# EAGLE design atmega32u4bb (EAGLE 6.0)
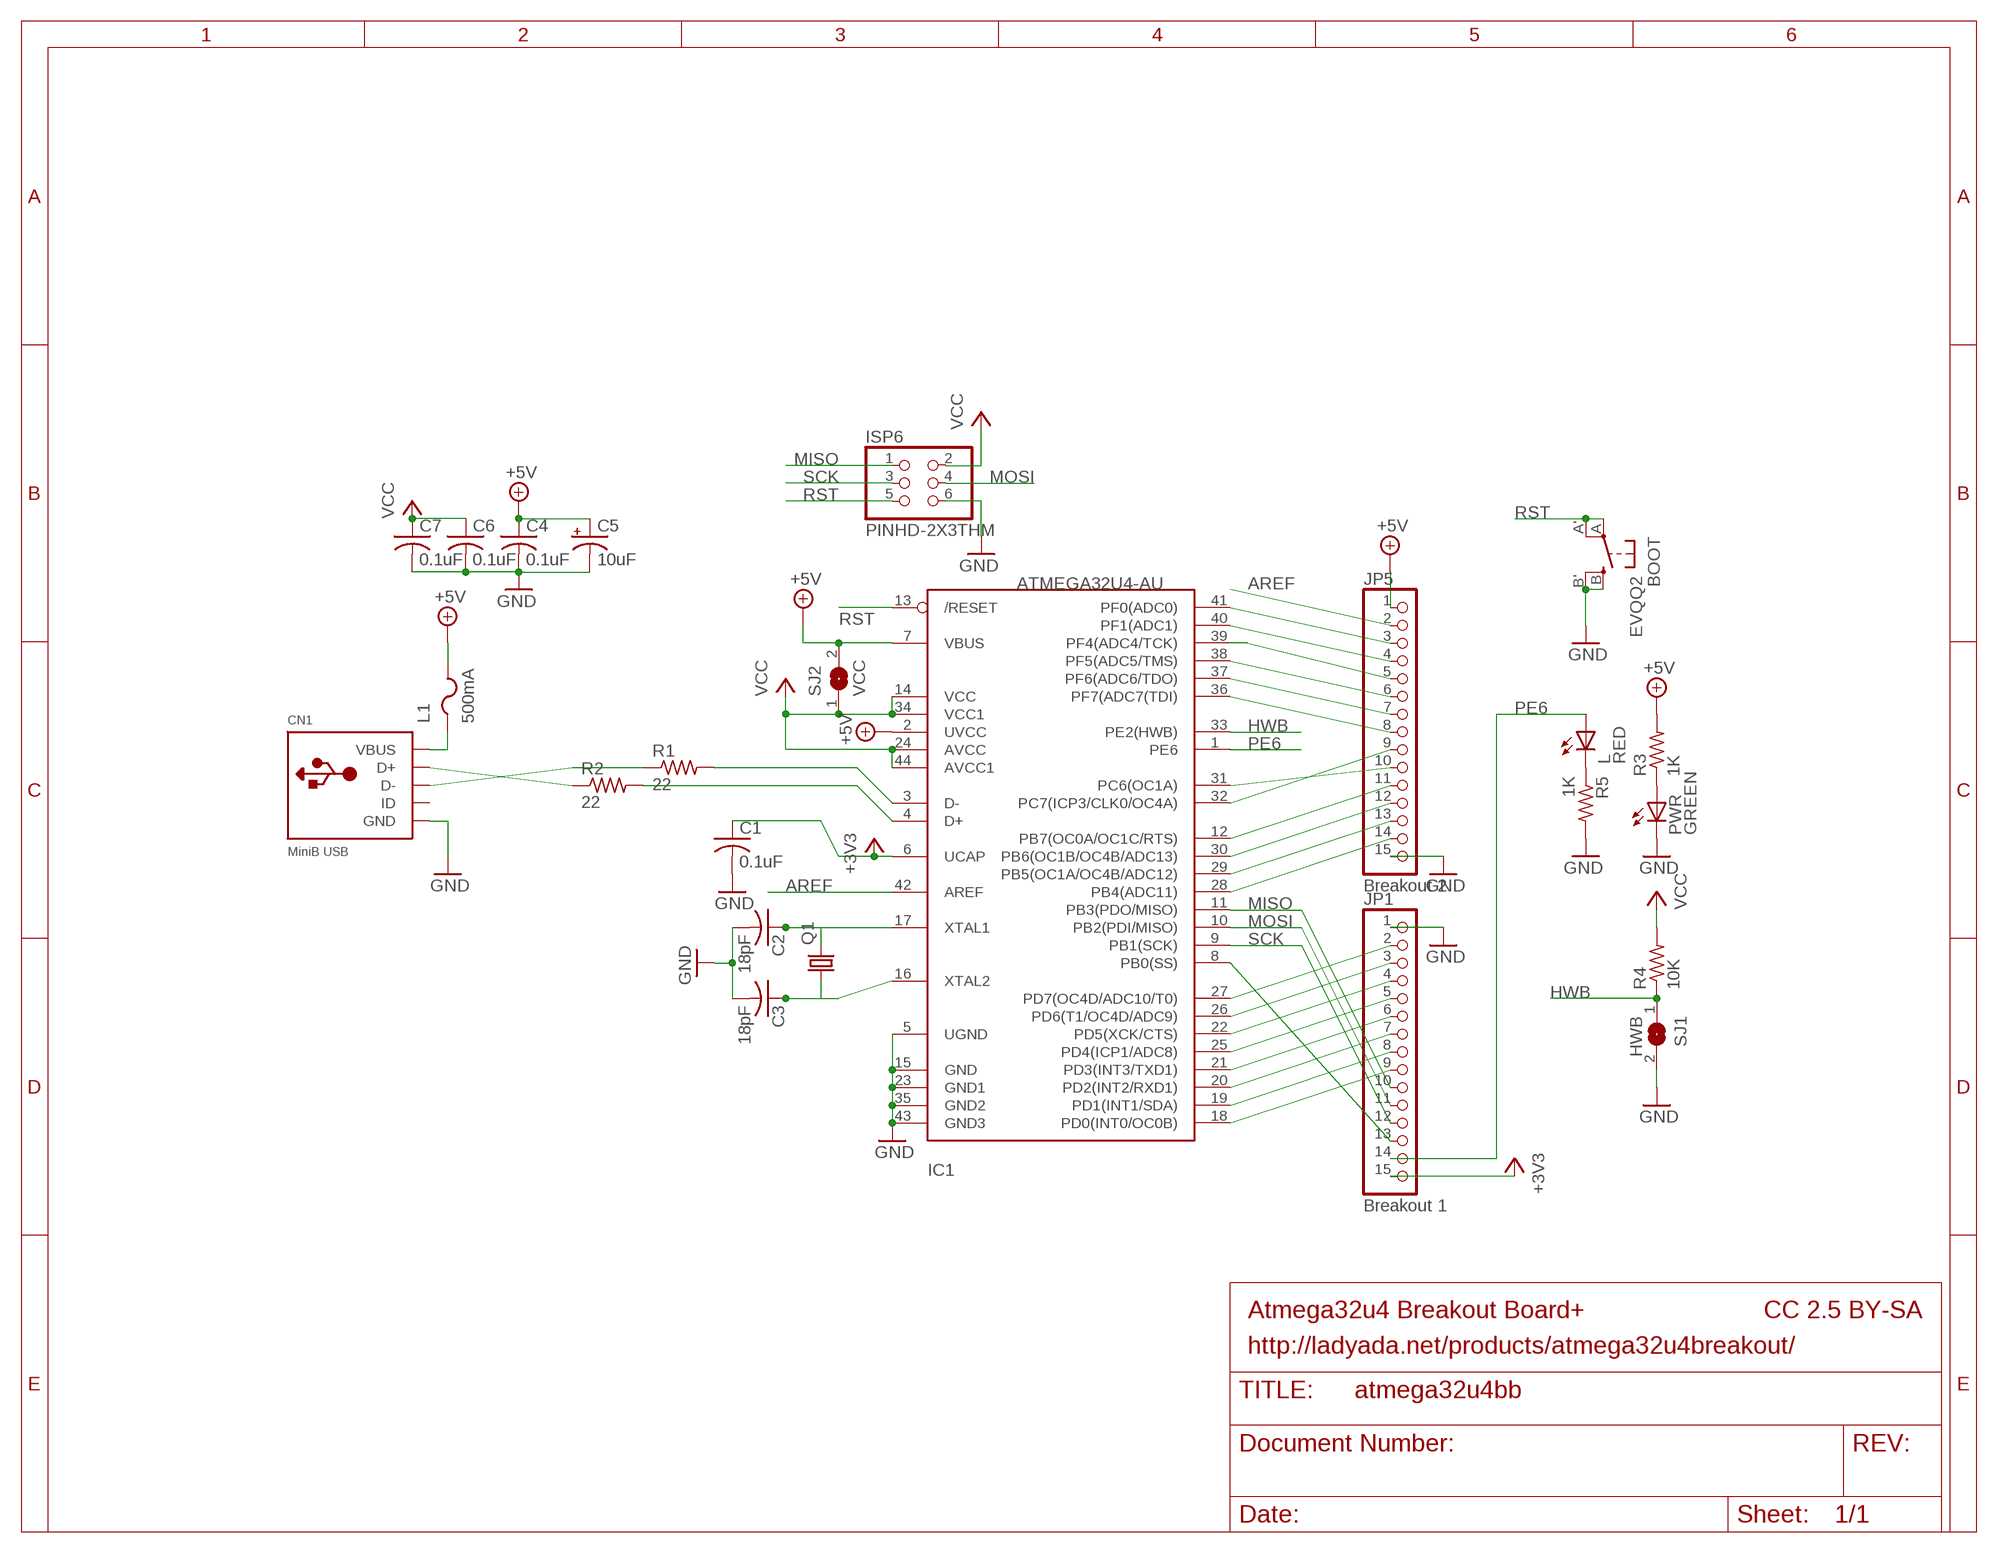
[diagram p0: schematic, sheet 1]

## Parts
BOOT  EVQQ2  [EVQ-Q2]
C1  0.1uF  C-USC0805K  [C0805K]
C2  18pF  C-USC0805K  [C0805K]
C3  18pF  C-USC0805K  [C0805K]
C4  0.1uF  C-USC0805K  [C0805K]
C5  10uF  CPOL-USA/3216-18R  [A/3216-18R]
C6  0.1uF  C-USC0805K  [C0805K]
C7  0.1uF  C-USC0805K  [C0805K]
CN1  MiniB USB  USBMINIB  [USB-MINIB]
IC1  ATMEGA32U4-AU  [TQFP44]
ISP6  PINHD-2X3THM  [ISP6]
JP1  Breakout 1  PINHD-1X15-CB  [1X15-CB]
JP5  Breakout 2  PINHD-1X15-CB  [1X15-CB]
L  RED  LEDCHIPLED_0805  [CHIPLED_0805]
L1  500mA  PTCFUSE-1206  [R1206]
PWR  GREEN  LEDCHIPLED_0805  [CHIPLED_0805]
Q1  CRYSTALHC49UP  [HC49UP]
R1  22  R-US_R0805  [R0805]
R2  22  R-US_R0805  [R0805]
R3  1K  R-US_R0805  [R0805]
R4  10K  R-US_R0805  [R0805]
R5  1K  R-US_R0805  [R0805]
SJ1  HWB  SJ  [SJ]
SJ2  VCC  SJ  [SJ]

## Nets
+3V3: C1.1 IC1.6(UCAP) JP1.15
+5V: C4.1 C5.+ IC1.2(UVCC) IC1.7(VBUS) JP5.1 L1.2 R3.2 SJ2.2
AREF: IC1.42(AREF) JP5.2
GND: BOOT.B'(S1) BOOT.B(S) C1.2 C2.2 C3.2 C4.2 C5.- C6.2 C7.2 CN1.GND IC1.5(UGND) IC1.15(GND) IC1.23(GND1) IC1.35(GND2) IC1.43(GND3) ISP6.6 JP1.1 JP5.15 PWR.C R5.2 SJ1.2
HWB: IC1.33(PE2(HWB)) R4.1 SJ1.1
MISO: IC1.11(PB3(PDO/MISO)) ISP6.1 JP1.10
MOSI: IC1.10(PB2(PDI/MISO)) ISP6.4 JP1.11
N$1: PWR.A R3.1
N$2: CN1.D+ R2.1
N$3: IC1.3(D-) R1.2
N$4: IC1.4(D+) R2.2
N$5: CN1.D- R1.1
N$8: C2.1 IC1.17(XTAL1) Q1.2
N$9: C3.1 IC1.16(XTAL2) Q1.1
N$10: L.C R5.1
PB0: IC1.8(PB0(SS)) JP1.13
PB4: IC1.28(PB4(ADC11)) JP5.14
PB5: IC1.29(PB5(OC1A/OC4B/ADC12)) JP5.13
PB6: IC1.30(PB6(OC1B/OC4B/ADC13)) JP5.12
PB7: IC1.12(PB7(OC0A/OC1C/RTS)) JP5.11
PC6: IC1.31(PC6(OC1A)) JP5.10
PC7: IC1.32(PC7(ICP3/CLK0/OC4A)) JP5.9
PD0: IC1.18(PD0(INT0/OC0B)) JP1.9
PD1: IC1.19(PD1(INT1/SDA)) JP1.8
PD2: IC1.20(PD2(INT2/RXD1)) JP1.7
PD3: IC1.21(PD3(INT3/TXD1)) JP1.6
PD4: IC1.25(PD4(ICP1/ADC8)) JP1.5
PD5: IC1.22(PD5(XCK/CTS)) JP1.4
PD6: IC1.26(PD6(T1/OC4D/ADC9)) JP1.3
PD7: IC1.27(PD7(OC4D/ADC10/T0)) JP1.2
PE6: IC1.1(PE6) JP1.14 L.A
PF0: IC1.41(PF0(ADC0)) JP5.3
PF1: IC1.40(PF1(ADC1)) JP5.4
PF4: IC1.39(PF4(ADC4/TCK)) JP5.5
PF5: IC1.38(PF5(ADC5/TMS)) JP5.6
PF6: IC1.37(PF6(ADC6/TDO)) JP5.7
PF7: IC1.36(PF7(ADC7(TDI)) JP5.8
RST: BOOT.A'(P1) BOOT.A(P) IC1.13(/RESET) ISP6.5
SCK: IC1.9(PB1(SCK)) ISP6.3 JP1.12
VBUS: CN1.VBUS L1.1
VCC: C6.1 C7.1 IC1.14(VCC) IC1.24(AVCC) IC1.34(VCC1) IC1.44(AVCC1) ISP6.2 R4.2 SJ2.1
Unconnected: CN1.ID

## Notes on the sheet
- Atmega32u4 Breakout Board+ | CC 2.5 BY-SA
- http://ladyada.net/products/atmega32u4breakout/

## Library data of the parts
BOOT = adaprog:EVQQ2
C1-C4 C6 C7 = adafruit:C-US: CAPACITOR, American symbol
C5 = adafruit:CPOL-US: POLARIZED CAPACITOR, American symbol
CN1 = adafruit:USB: USB Connectors USBMINIB - Surface Mount Female Mini-B USB Connector 4UConnector: 06564 By microbuilder.eu Thru-hole RA Female Mini-B USB Connector 4UConnector: 18732 By ladyada.net
IC1 = adaprog:ATMEGA32U4
ISP6 = adaprog:PINHD-2X3
JP1 JP5 = adafruit:PINHD-1X15: PIN HEADER
L PWR = adafruit:LED: LED OSRAM: - CHIPLED LG R971, LG N971, LY N971, LG Q971, LY Q971, LO R971, LY R971 LH N974, LH R974 LS Q976, LO Q976, LY Q976 LO Q996 - Hyper CHIPLED LW Q18S LB Q993, LB Q99A, LB R99A - SideLED LS A670, LO A670, LY A670, LG A670, LP A670 LB A673, LV A673, LT A673, LW A673 LH A674 LY A675 LS A676, LA A676, LO A676, LY A676, LW A676 LS A679, LY A679, LG A679 - Hyper Micro SIDELED® LS Y876, LA Y876, LO Y876, LY Y876 LT Y87S - SmartLED LW L88C, LW L88S LB L89C, LB L89S, LG L890 LS L89K, LO L89K, LY L89K LS L896, LA L896, LO L896, LY L896 - TOPLED LS T670, LO T670, LY T670, LG T670, LP T670 LSG T670, LSP T670, LSY T670, LOP T670, LYG T670 LG T671, LOG T671, LSG T671 LB T673, LV T673, LT T673, LW T673 LH T674 LS T676, LA T676, LO T676, LY T676, LB T676, LH T676, LSB T676, LW T676 LB T67C, LV T67C, LT T67C, LS T67K, LO T67K, LY T67K, LW E67C LS E67B, LA E67B, LO E67B, LY E67B, LB E67C, LV E67C, LT E67C LW T67C LS T679, LY T679, LG T679 LS T770, LO T770, LY T770, LG T770, LP T770 LB T773, LV T773, LT T773, LW T773 LH T774 LS E675, LA E675, LY E675, LS T675 LS T776, LA T776, LO T776, LY T776, LB T776 LHGB T686 LT T68C, LB T68C - Hyper Mini TOPLED® LB M676 - Mini TOPLED Santana® LG M470 LS M47K, LO M47K, LY M47K Source: http://www.osram.convergy.de/
L1 = adafruit:PTCFUSE: PTC fuses, resettable thermistors
Q1 = crystal:CRYSTAL: CRYSTAL; OC_FARNELL: unknown; OC_NEWARK: unknown
R1-R5 = adafruit:R-US_: RESISTOR, American symbol
SJ1 SJ2 = jumper:SJ: SMD solder JUMPER

## Board
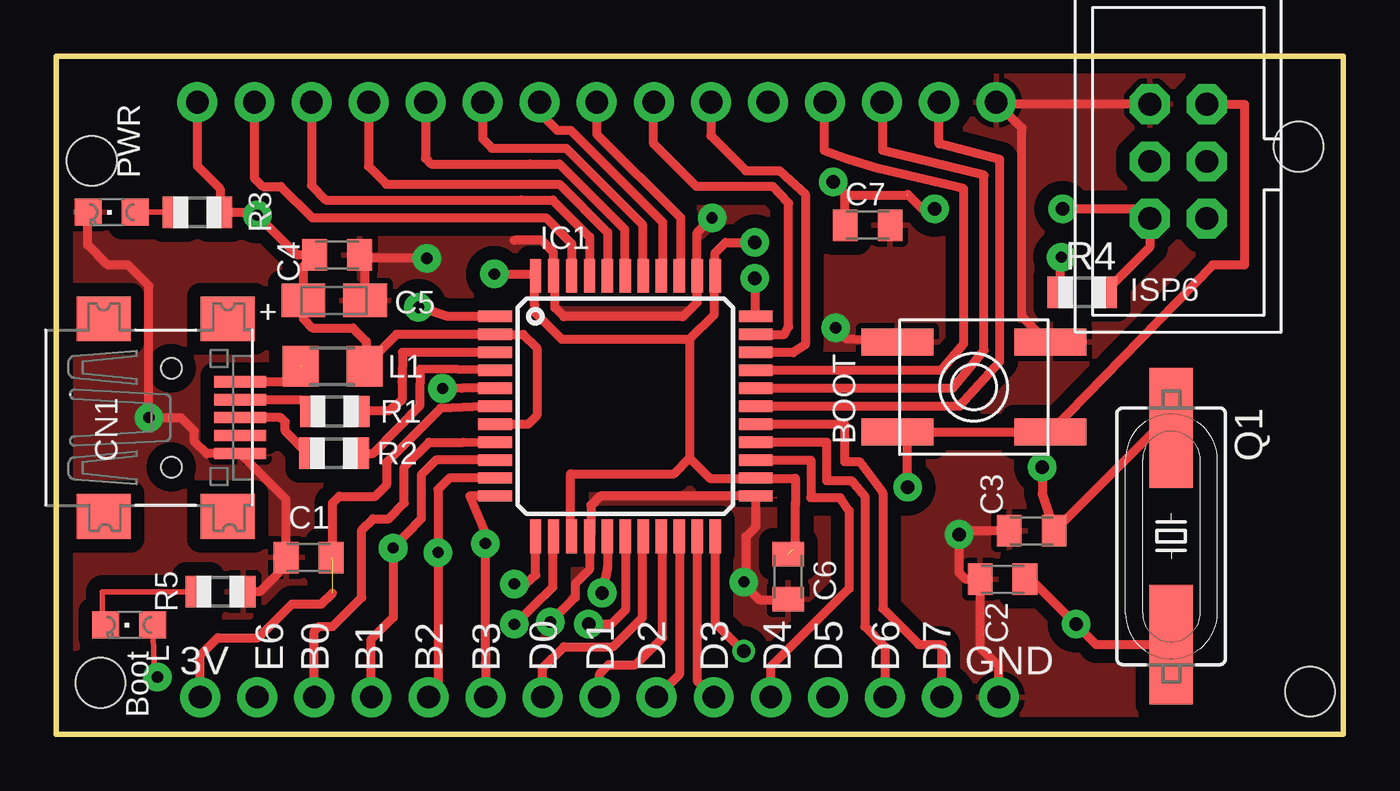
[diagram p1: board, top side]
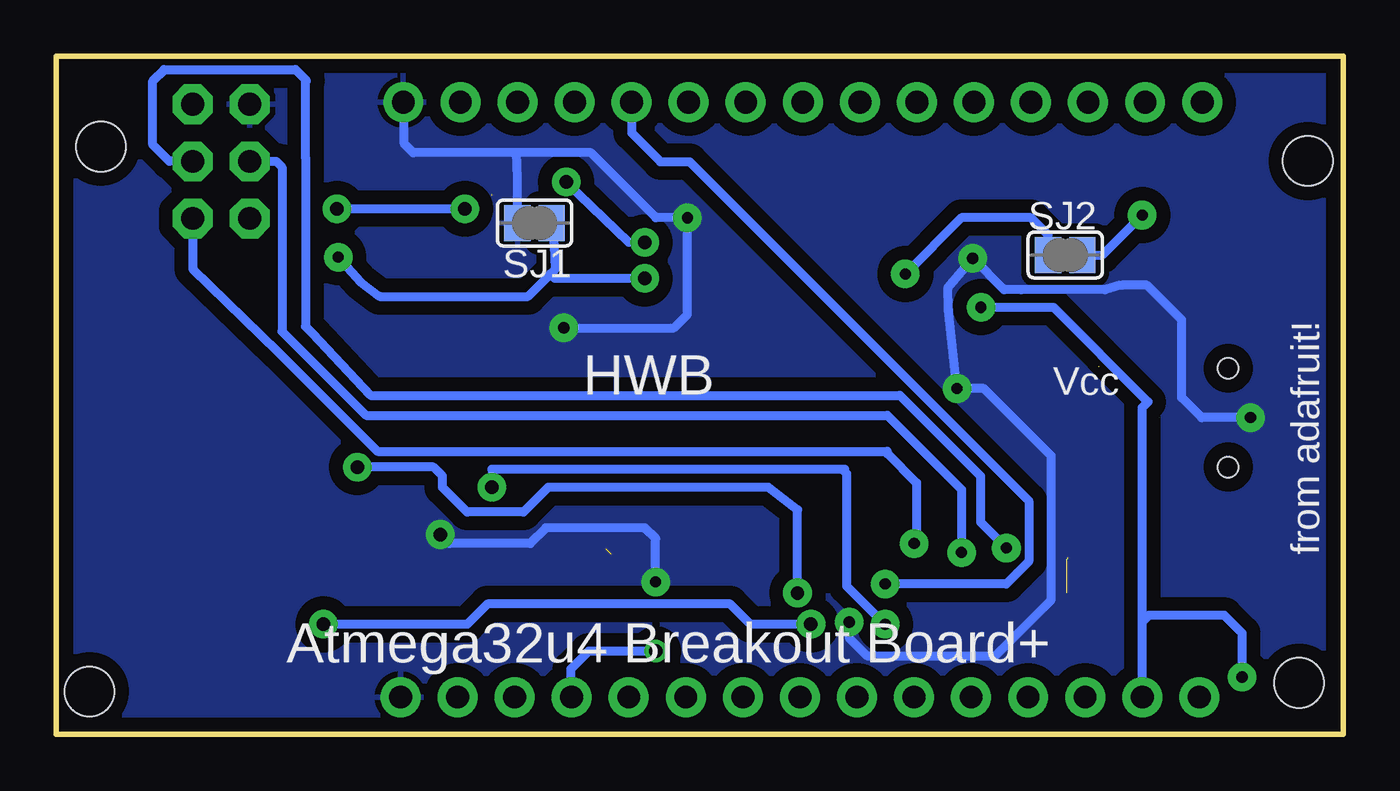
[diagram p2: board, bottom side, seen from below]

Size 57.3 x 30.2 mm. Coordinates in mm from the lower left corner, seen from the top.
Outline: 0.4,30.2 0.5,30.2
Outline: 0.5,30.2 57.3,30.2 57.3,0 0,0 0,30.2 0.5,30.2
Copper layers (1*16): Top 0.035mm / dielectric 1.5mm / Bottom 0.035mm
Design rules: minimum track width 10mil, minimum drill 19mil, track to track 10mil, track to pad 10mil, pad to pad 10mil, via to via 10mil, smd to smd 0mil, copper to edge 25mil, drill to drill 8mil, minimum pad ring 10mil, minimum via ring 8mil, stop-mask expansion 4mil, vias tented up to drill 20mil, thermal gap 10mil
Holes 2.2 mm at 1.59,25.54 1.97,2.29 55.31,26.17 55.81,1.91

### Footprints (pad centres in the part's own frame; a part is rotated, then mirrored left to right if it is on the bottom)
EVQ-Q2 = smd 3.2 x 1.2: A -3.4,-2; A' 3.4,-2; B -3.4,2; B' 3.4,2
C0805K = smd 1.1 x 1.4: 1 -1,0; 2 1,0
A/3216-18R = smd 1.95 x 1.5: + 1.375,0; - -1.375,0
USB-MINIB = smd 0.5 x 2.308: D+ 0,4.064; D- -0.8,4.064; GND 1.6,4.064; ID 0.8,4.064; VBUS -1.6,4.064 | smd 2 x 2.4: GND1 -4.4,-2; GND2 -4.4,3.5; GND3 4.4,3.5; GND4 4.4,-2 | hole 0.9: -2.2,1; 2.2,1
TQFP44 = smd 1.5 x 0.5: 1 -5.8,4; 2 -5.8,3.2; 3 -5.8,2.4; 4 -5.8,1.6; 5 -5.8,0.8; 6 -5.8,0; 7 -5.8,-0.8; 8 -5.8,-1.6; 9 -5.8,-2.4; 10 -5.8,-3.2; 11 -5.8,-4; 23 5.8,-4; 24 5.8,-3.2; 25 5.8,-2.4; 26 5.8,-1.6; 27 5.8,-0.8; 28 5.8,0; 29 5.8,0.8; 30 5.8,1.6; 31 5.8,2.4; 32 5.8,3.2; 33 5.8,4 | smd 0.5 x 1.5: 12 -4,-5.8; 13 -3.2,-5.8; 14 -2.4,-5.8; 15 -1.6,-5.8; 16 -0.8,-5.8; 17 0,-5.8; 18 0.8,-5.8; 19 1.6,-5.8; 20 2.4,-5.8; 21 3.2,-5.8; 22 4,-5.8; 34 4,5.8; 35 3.2,5.8; 36 2.4,5.8; 37 1.6,5.8; 38 0.8,5.8; 39 0,5.8; 40 -0.8,5.8; 41 -1.6,5.8; 42 -2.4,5.8; 43 -3.2,5.8; 44 -4,5.8
ISP6 = drill 1.016 pad 1.778 octagon: 1 -2.54,-1.27; 2 -2.54,1.27; 3 0,-1.27; 4 0,1.27; 5 2.54,-1.27; 6 2.54,1.27
1X15-CB = drill 1.016 pad 1.778: 1 -17.78,0; 2 -15.24,0; 3 -12.7,0; 4 -10.16,0; 5 -7.62,0; 6 -5.08,0; 7 -2.54,0; 8 0,0; 9 2.54,0; 10 5.08,0; 11 7.62,0; 12 10.16,0; 13 12.7,0; 14 15.24,0; 15 17.78,0
CHIPLED_0805 = smd 1.2 x 1.2: A 0,-1.05; C 0,1.05
R1206 = smd 1.6 x 1.803: 1 -1.422,0; 2 1.422,0
HC49UP = smd 5.334 x 1.93: 1 -4.826,0; 2 4.826,0
R0805 = smd 1.1 x 1.4: 1 -1,0; 2 1,0
SJ = smd 1.168 x 1.6: 1 -0.762,0; 2 0.762,0

### Placement (x,y rotation side)
BOOT  40.85,15.46 0 top
C1  11.24,7.88 180 top
C2  42.13,6.91 180 top
C3  43.43,9.06 180 top
C4  12.51,21.34 0 top
C5  12.38,19.32 180 top
C6  32.58,7.02 270 top
C7  36.12,22.67 0 top
CN1  4.13,14.11 270 top
IC1  25.34,14.61 0 top
ISP6  49.95,25.51 90 top
JP1  24.19,1.66 180 top
JP5  24.07,28.15 0 top
L  3.26,4.88 90 top
L1  12.3,16.38 0 top
PWR  2.47,23.25 90 top
Q1  49.64,8.82 270 top
R1  12.4,14.38 0 top
R2  12.37,12.52 0 top
R3  6.29,23.25 0 top
R4  45.67,19.68 0 top
R5  7.32,6.35 0 top
SJ1  36,22.77 180 bottom
SJ2  12.38,21.34 0 bottom

### Tracks (layer width: path | path; a pad name or v marks a point on that pad's centre or on a via)
+3V3  (2 unrouted)
  Top 0.406: IC1.6 17.11,14.51 14.7,12.1 14.7,11.1 14.3,10.7 14.2,10.6 12.6,10.6 12.3,10.3 12.3,7.8 | JP1.15 6.41,3.51 7.2,4.3 9,4.3 10.5,5.8 11.8,5.8 12.3,6.3
+5V  (via drill 0.5 pad 1.27)
  Top 0.406: JP5.1 6.29,25.32 7.3,24.3 7.3,23.26 | 7.3,23.26 R3.2 | 7.3,23.26 8.81,23.26 v8.95,23.12 10.73,21.34 C4.1 11.01,20.84 C5.+ 11.01,18.49 11.4,18.1 13.2,18.1 13.8,17.5 13.8,16.46 L1.2 15.15,17.81 16.31,17.81 IC1.2 20.79,17.81 21.4,17.2 21.4,14.2 21,13.8 19.55,13.8 IC1.7
  Bottom 0.406: SJ2.2 10.73,21.34 v8.95,23.12
AREF
  Top 0.406: JP5.2 8.83,24.77 9.2,24.4 10,24.4 11.4,23 20.5,23 21.8,23 22.95,21.85 22.95,20.35 IC1.42
GND  (via drill 0.5 pad 1.27, 0.6 pad 1.27)
  Top 0.406: PWR.C 1.4,23.22 1.4,21.8 2.3,20.9 3.2,20.9 4.13,19.97 v4.13,14.11 5.54,14.11 6.15,13.5 6.15,13.05 6.69,12.51 CN1.GND 10.24,10.46 C1.2 9.94,7.88 9.94,7.24 9.05,6.35 R5.2 | C5.- 13.76,21.1 C4.2 13.65,21.2 v16.5,21.2 | IC1.5 18.06,15.41 v17.2,15.4 | IC1.35 28.54,19.24 | 28.54,19.24 27.9,18.6 22.6,18.6 22.2,19 22.2,20.35 IC1.43 22.14,21.46 21.6,22 20.4,22 | 28.54,19.24 28.54,22.34 v29.2,23 | C6.2 32.56,6 31.3,6 30.62,6.68 v30.62,6.79 30.7,6.87 30.7,8.8 31.1,9.2 31.14,9.24 IC1.23 24.21,10.61 23.8,10.2 23.8,8.88 IC1.15 23.74,7.34 23.1,6.7 23.1,6.1 v22,5 | BOOT.B 35.19,17.61 v34.7,18.1 | BOOT.B' 43.99,17.61 43,18.6 43,27 JP5.15 41.94,28.05 ISP6.6 | JP1.1 41.95,1.68 41.95,3.05 41.13,3.87 C2.2 40.49,6.91 40.2,7.2 v40.2,8.89 v40.19,8.9 40.35,9.06 C3.2
  Bottom 0.406: 17.58,18.91 v17.2,15.4 16,15.4 13,12.4 13,6 15.5,3.5 21.2,3.5 22,4.3 v22,5 | 17.58,18.91 17.6,19.9 v16.5,21.2 15.1,19.8 14.35,19.8 10.6,19.8 9.92,20 | 17.59,18.9 17.58,18.91 | 36.8,25.9 33.5,25.9 30.6,23 v29.2,23 29.2,18.7 29.8,18.1 v34.7,18.1 | 36.8,25.9 41.4,25.9 41.8,26.3 41.8,28.11 JP5.15 | SJ1.2 36.77,24.77 36.8,25.9 | v30.62,6.79 30.62,8.72 31.1,9.2 35.5,9.2 36.2,8.5 39.79,8.5 v40.19,8.9 | v4.13,14.11 6.3,14.11 7.2,15 7.2,18.45 8.75,20 9.85,20
  pour Top (isolate 0.61): -0.32,-0.12 -0.32,30.85 57.78,31.1 57.72,0.01
  pour Bottom (isolate 0.61): 0.1,30.44 0.1,-0.12 57.34,0.01 57.24,30.69
HWB  (via drill 0.5 pad 1.27, 0.6 pad 1.27)
  Top 0.406: IC1.33 31.14,20.26 v31.1,20.3 | R4.1 44.67,20.03 v44.75,21.25
  Bottom 0.406: SJ1.1 35.14,21.76 35.1,20.7 35.3,20.5 | v44.75,21.25 43.75,20.15 42.9,19.5 36.3,19.5 35.3,20.5 | v31.1,20.3 35.1,20.3 35.3,20.5
MISO  (via drill 0.5 pad 1.27)
  Top 0.406: IC1.11 18.41,10.61 19.1,9 v19.1,8.5 19.1,4.29 19.11,3.18 JP1.10
  Bottom 0.406: v19.1,8.5 19,8.6 19,11.2 20.3,12.5 20.3,12.6 43,12.6 47.43,17.03 51.22,20.72 ISP6.1
MOSI  (via drill 0.5 pad 1.27)
  Top 0.406: IC1.10 17.51,11.41 17,10.9 v17,8.1 17,2.09 JP1.11
  Bottom 0.406: v17,8.1 17,10.9 20.3,14.2 43.5,14.2 47.2,17.9 47.25,17.95 47.25,25.25 47.51,25.51 ISP6.4
N$1
  Top 0.254: R3.1 PWR.A
N$2  (1 unrouted)
  Top 0.406: R2.1 11.18,12.52 10.2,13.5 10.2,13.9 10,14.1 CN1.D+
N$3
  Top 0.406: IC1.3 15.41,17.01 15.4,15.7 15.4,14.9 14.8,14.4 13.42,14.4 R1.2
N$4
  Top 0.406: R2.2 14.12,12.52 16.2,14.65 16.2,15.6 16.2,16.26 IC1.4
N$5
  Top 0.406: CN1.D- 10.87,14.9 R1.1
N$8  (via drill 0.6 pad 1.27)
  Top 0.406: IC1.17 25.34,5.54 24.7,4.9 v23.7,4.9 | C2.1 43.39,6.91 v45.4,4.9 46.3,4 Q1.2
  Bottom 0.406: v23.7,4.9 26.4,4.9 27.3,5.8 38.1,5.8 39,4.9 41.1,4.9 v45.4,4.9
N$9  (via drill 0.6 pad 1.27)
  Top 0.406: IC1.16 24.54,7.44 v24.3,6.3 | v43.9,11.9 43.9,10.69 C3.1 49.01,13.65 Q1.1
  Bottom 0.406: v24.3,6.3 24.3,10 25.6,11 35.4,11 36.5,9.9 39,9.9 40.1,11 40.1,11.5 40.5,11.9 v43.9,11.9
N$10
  Top 0.254: R5.1 5.92,6.35 2.06,6.35 2.06,4.96 L.C
PB0
  Top 0.406: JP1.13 11.49,4.59 11.7,4.8 12.3,4.8 13.6,6.1 13.6,9.1 14.1,9.6 14.8,9.6 15.5,10.3 15.5,11.9 16.6,13 18.12,13 IC1.8
PB4
  Top 0.406: IC1.28 40.21,14.61 42,16.6 42,25.6 39.3,26.3 JP5.14
PB5
  Top 0.406: IC1.29 39.91,15.41 41.3,17.1 41.3,24.9 36.8,26 36.8,27.99 JP5.13
PB6
  Top 0.406: IC1.30 39.41,16.21 40.4,17.4 40.4,24.3 36.6,25.2 35.3,25.6 34.2,26 34.2,28.13 JP5.12
PB7  (via drill 0.5 pad 1.27)
  Top 0.406: v20.4,6.7 20.9,6.7 21.35,7.1 21.35,8.65 IC1.12
  Bottom 0.406: JP5.11 31.68,26.79 30.4,25.5 29.1,25.5 14,10.4 14,7.7 14.5,7.2 15,6.7 v20.4,6.7
PC6
  Top 0.406: JP5.10 29.14,26.66 30.7,25.1 32.2,25.1 33.35,24.05 33.35,17.35 32.8,17 IC1.31
PC7
  Top 0.406: IC1.32 32.41,17.81 32.6,18.15 32.6,23.65 31.9,24.4 28.5,24.4 26.6,26.3 JP5.9
PD0
  Top 0.406: JP1.9 21.65,2.95 22.6,3.9 24.8,3.9 26.1,5.2 26.1,8.78 IC1.18
PD1
  Top 0.406: JP1.8 24.19,2.69 24.6,3.1 25.8,3.1 27,4.3 27,8.75 IC1.19
PD2
  Top 0.406: IC1.20 27.74,2.67 JP1.7
PD3
  Top 0.406: IC1.21 28.54,2.39 JP1.6
PD4
  Top 0.406: IC1.25 33.6,12.21 33.6,10.55 34.9,10.55 35.3,9.95 35.3,6.5 31.8,3 31.8,1.67 JP1.5
PD5  (via drill 0.6 pad 0.81)
  Top 0.406: IC1.22 29.34,4.96 v30.6,3.7
  Bottom 0.406: v30.6,3.7 33.6,3.7 34.4,2.9 34.4,1.71 JP1.4
PD6
  Top 0.406: IC1.26 34.3,13.01 34.3,11.3 35.4,11.3 36,10.6 36,4.8 36.9,3.9 JP1.3
PD7
  Top 0.406: IC1.27 35.1,13.81 35.1,12.15 35.75,12.15 36.8,10.75 36.8,5.6 38.4,4 39.4,4 39.43,3.97 JP1.2
PE6  (via drill 0.5 pad 1.27)
  Top 0.254: L.A 4.38,2.64 v4.51,2.55
  Top 0.406: IC1.1 17.43,18.61 v16.13,19.02
  Bottom 0.406: v16.13,19.02 12.92,19.02 8.7,14.8 8.95,14.55 8.95,5 | JP1.14 8.95,5 | v4.51,2.55 4.51,4.51 5.3,5.3 8.65,5.3 8.95,5
PF0
  Top 0.406: JP5.3 11.37,24.43 12,23.8 20.7,23.8 22.1,23.8 23.75,22.15 23.75,20.52 IC1.41
PF1
  Top 0.406: JP5.4 13.91,25.3 14.7,24.5 21,24.5 22.4,24.5 24.55,22.35 IC1.40
PF4
  Top 0.406: JP5.5 16.45,25.66 16.7,25.4 21.1,25.4 22.4,25.4 25.3,22.5 25.3,20.45 IC1.39
PF5
  Top 0.406: JP5.6 18.98,26.52 19.4,26.1 21.2,26.1 22.7,26.1 26.1,22.7 26.1,20.45 IC1.38
PF6
  Top 0.406: JP5.7 21.53,27.68 22.3,26.9 22.9,26.9 27,22.8 27,20.48 IC1.37
PF7
  Top 0.406: JP5.8 24.07,26.73 27.8,23 27.8,20.48 IC1.36
RST  (via drill 0.5 pad 1.27, 0.6 pad 1.27)
  Top 0.406: IC1.13 22.1,8.41 22.1,6.55 v20.4,4.9 | v37.9,11 37.9,13.6 37.4,13.6 BOOT.A BOOT.A' 51.49,20.9 52.9,20.9 52.9,28.05 ISP6.5
  Bottom 0.406: 22.2,11.8 22.3,11.8 | 22.3,11.8 37.9,11.8 v37.9,11 | v20.4,4.9 22.1,6.6 22.1,11.6 22.2,11.7 22.3,11.8
SCK  (via drill 0.5 pad 1.27)
  Top 0.406: IC1.9 16.91,12.21 16.25,11.55 16.25,9.6 v15,8.3 15,5.2 14,4.2 14,1.69 JP1.12
  Bottom 0.406: v15,8.3 16.15,9.45 16.15,11.5 19.75,15.1 43.3,15.1 45.88,17.84 46.2,18.16 46.2,25.7 46.2,29.05 46.15,29.1 46.65,29.6 52.5,29.6 53,29.1 53,26.25 52.26,25.51 ISP6.3
VBUS  (1 unrouted)
  Top 0.406: 10.9,16.4 10.26,15.75 10.21,15.7 CN1.VBUS
VCC  (via drill 0.5 pad 1.27, 0.6 pad 1.27)  (2 unrouted)
  Top 0.254: 32.83,8.26 32.9,8.16
  Top 0.406: v19.5,20.5 21.25,20.5 IC1.44 21.3,20.38 21.3,19.1 21.3,18.8 22.5,17.6 28.2,17.6 | 28.2,17.6 29.3,18.7 29.3,20.38 IC1.34 29.34,21.44 29.8,21.9 v31.1,21.9 | 28.2,17.6 28.2,12.3 | 28.2,12.3 29.1,11.4 31.12,11.4 | 31.12,11.4 IC1.24 | IC1.14 22.9,8.81 22.9,11.6 27.5,11.6 28.2,12.3 | 31.12,11.4 32.9,11.4 32.9,10.3 32.9,10.2 32.9,8.16 | v44.8,23.4 48.26,23.4 ISP6.2 48.68,21.69 R4.2 | C7.1 35.12,24.08 | 35.12,24.08 v34.6,24.6 | v39.1,23.4 38.55,23.4 37.9,24.05 | 37.9,24 35.2,24 35.12,24.08
  Bottom 0.406: SJ2.1 13.14,22.24 13.9,23 17,23 v19.5,20.5 | v31.1,21.9 31.8,21.9 v34.6,24.6 | v44.8,23.4 v39.1,23.4

### Text on the board
tPlace: 3V | E6 | B0 | B1 | B2 | B3 | D0 | D1 | D2 | D3 | D4 | D5 | D6 | D7 | GND | Boot
bPlace: from adafruit! | Vcc | HWB | Atmega32u4 Breakout Board+